# Altium schematic sheet Pneumatics Control Board MSP4302433.SchDoc
size A; SheetNumber: 1; SheetTotal: 2
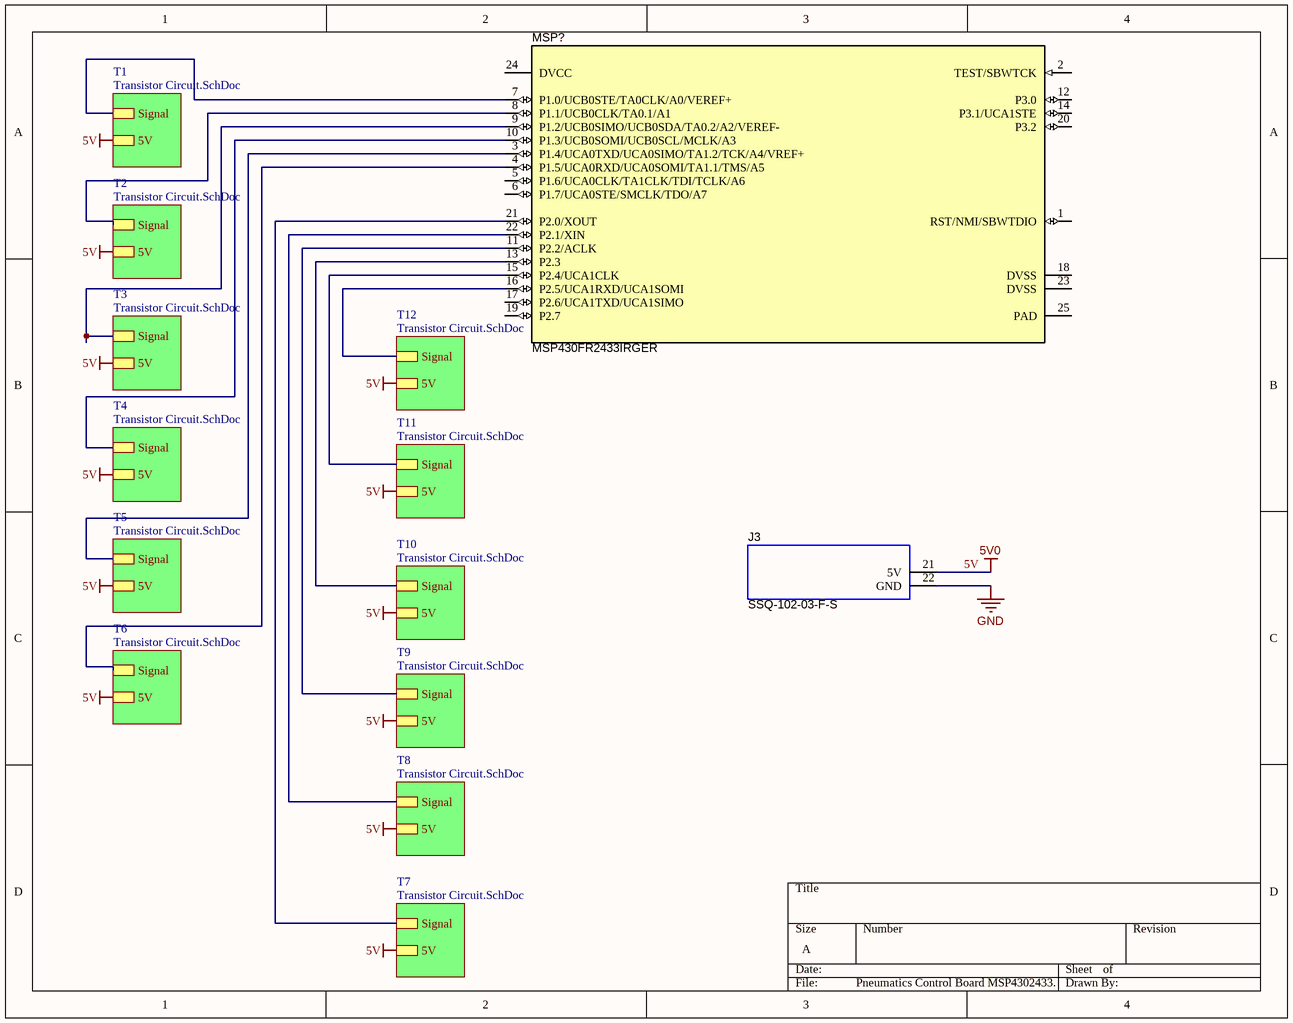
[diagram p0: Pneumatics Control Board MSP4302433.SchDoc]

## Parts
J3  SSQ-102-03-F-S  [BoosterPack_20pin_J3]
MSP?  MSP430FR2433IRGER  [RGE0024H]

## Sub-sheets
T1 = Transistor Circuit.SchDoc: Signal, 5V
T2 = Transistor Circuit.SchDoc: Signal, 5V
T3 = Transistor Circuit.SchDoc: Signal, 5V
T4 = Transistor Circuit.SchDoc: Signal, 5V
T5 = Transistor Circuit.SchDoc: Signal, 5V
T6 = Transistor Circuit.SchDoc: Signal, 5V
T7 = Transistor Circuit.SchDoc: Signal, 5V
T8 = Transistor Circuit.SchDoc: Signal, 5V
T9 = Transistor Circuit.SchDoc: Signal, 5V
T10 = Transistor Circuit.SchDoc: Signal, 5V
T11 = Transistor Circuit.SchDoc: Signal, 5V
T12 = Transistor Circuit.SchDoc: Signal, 5V

## Nets
5V: J3.21(5V) ; sheet T7/5V, sheet T8/5V, sheet T9/5V, sheet T10/5V, sheet T11/5V, sheet T12/5V, sheet T1/5V, sheet T6/5V, sheet T5/5V, sheet T4/5V, sheet T3/5V, sheet T2/5V  [also labelled 5V0]
GND: J3.22(GND)
NetMSP?_3: MSP?.3(P1.4/UCA0TXD/UCA0SIMO/TA1.2/TCK/A4/VREF+) ; sheet T5/Signal
NetMSP?_4: MSP?.4(P1.5/UCA0RXD/UCA0SOMI/TA1.1/TMS/A5) ; sheet T6/Signal
NetMSP?_7: MSP?.7(P1.0/UCB0STE/TA0CLK/A0/VEREF+) ; sheet T1/Signal
NetMSP?_8: MSP?.8(P1.1/UCB0CLK/TA0.1/A1) ; sheet T2/Signal
NetMSP?_9: MSP?.9(P1.2/UCB0SIMO/UCB0SDA/TA0.2/A2/VEREF-) ; sheet T3/Signal
NetMSP?_10: MSP?.10(P1.3/UCB0SOMI/UCB0SCL/MCLK/A3) ; sheet T4/Signal
NetMSP?_11: MSP?.11(P2.2/ACLK) ; sheet T9/Signal
NetMSP?_13: MSP?.13(P2.3) ; sheet T10/Signal
NetMSP?_15: MSP?.15(P2.4/UCA1CLK) ; sheet T11/Signal
NetMSP?_16: MSP?.16(P2.5/UCA1RXD/UCA1SOMI) ; sheet T12/Signal
NetMSP?_21: MSP?.21(P2.0/XOUT) ; sheet T7/Signal
NetMSP?_22: MSP?.22(P2.1/XIN) ; sheet T8/Signal

Not connected (* = marked no-connect by the designer): MSP? 1(RST/NMI/SBWTDIO) 2(TEST/SBWTCK) 5(P1.6/UCA0CLK/TA1CLK/TDI/TCLK/A6) 6(P1.7/UCA0STE/SMCLK/TDO/A7) 12(P3.0) 14(P3.1/UCA1STE) 17(P2.6/UCA1TXD/UCA1SIMO) 18(DVSS) 19(P2.7) 20(P3.2) 23(DVSS) 24(DVCC) 25(PAD)

## Library data of the parts
J3 = BoosterPack_20pin_J3: Receptacle, 2.54mm, 2x1, Gold, TH; Manufacturer: Samtec; SymbolCreator: a0412235; Note: Booster Pack 20 pin J3; SymbolVersion: 2015-10-21; CompType: Receptacle; PartNumber: SSQ-102-03-F-S; RoHS: Y; PackageReference: 2x1 Receptacle; MountType: TH; ComponentLink1Description: Datasheet Link; Publisher: Texas Instruments; LatestRevisionDate: 2017-03-01; Supplier 1: Farnell; Supplier Part Number 1: 2283777
MSP? = MSP430FR2433IRGER: MSP430FR2433 16 MHz Ultra-Low-Power Microcontroller with 16 KB FRAM, 4 KB RAM, 19 IO, 4 Timers, RGE0024H (VQFN-24); Alternate PartNumber: MSP430FR2433IRGET; Manufacturer: Texas Instruments; SymbolCreator: Altium; SizeArea_mm2: 16; SizeAreaWB_mm2: 25; SizeX_mm: 4; SizeZ_mm: 1; CompType: IC; U/M: EA; Note: TI Provided; SymbolVersion: 2015-09-16; PartNumber: MSP430FR2433IRGER; PackageReference: RGE0024H; PackageDescription: VQFN-24; MountType: SMT; SizeY_mm: 4; ComponentLink1Description: Datasheet Link; ComponentLink1URL: http://www.ti.com/lit/ds/symlink/msp430fr2433.pdf; Publisher: Texas Instruments; LatestRevisionDate: 2017-03-06; Alternate Manufacturer: Texas Instruments